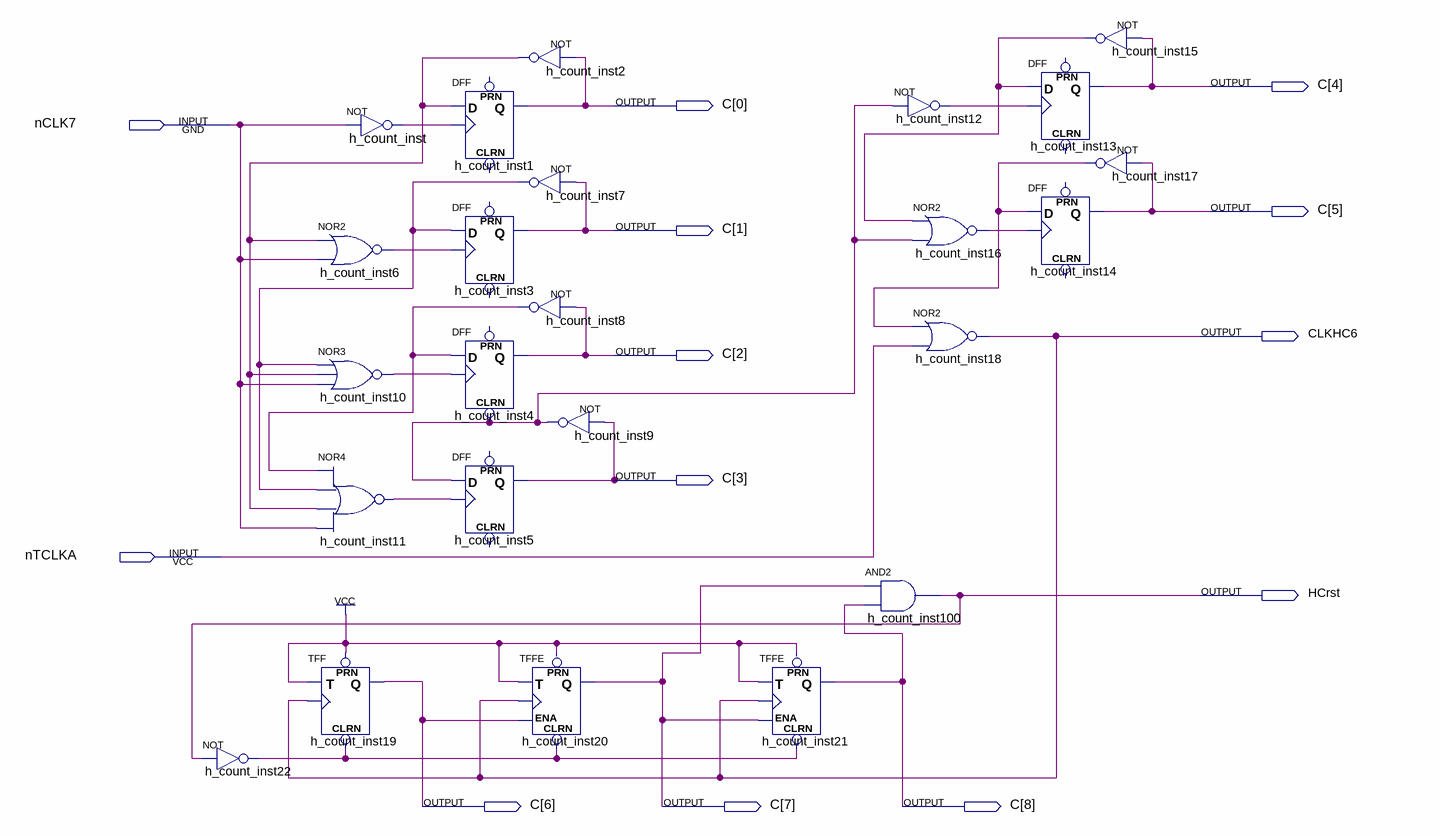
[diagram p0: schematic sheet]
// Quartus schematic ula_h_counter.bdf as structural Verilog: 24 symbols, 13 pins
module ula_h_counter (
  input  nCLK7,
  input  nTCLKA,
  output [8:0] C,
  output CLKHC6,
  output HCrst
);

  wire h_count_inst2_out, h_count_inst6_out, h_count_inst7_out, h_count_inst8_out, h_count_inst9_out,
       h_count_inst10_out, h_count_inst11_out, h_count_inst12_out, h_count_inst15_out, h_count_inst16_out,
       h_count_inst17_out, h_count_inst22_out, h_count_inst_out;

  not h_count_inst22 (h_count_inst22_out, HCrst);
  not h_count_inst (h_count_inst_out, nCLK7);
  nor h_count_inst6 (h_count_inst6_out, h_count_inst2_out, nCLK7);
  nor h_count_inst10 (h_count_inst10_out, h_count_inst7_out, h_count_inst2_out, nCLK7);
  nor h_count_inst11 (h_count_inst11_out, h_count_inst8_out, h_count_inst7_out, h_count_inst2_out, nCLK7);
  TFF h_count_inst19 (.PRN(1'b1), .CLRN(h_count_inst22_out), .T(1'b1), .CLK(CLKHC6), .Q(C[6]));
  DFF h_count_inst1 (.CLK(h_count_inst_out), .D(h_count_inst2_out), .Q(C[0]));  // open: CLRN, PRN
  DFF h_count_inst3 (.CLK(h_count_inst6_out), .D(h_count_inst7_out), .Q(C[1]));  // open: CLRN, PRN
  DFF h_count_inst4 (.CLRN(h_count_inst9_out), .CLK(h_count_inst10_out), .D(h_count_inst8_out), .Q(C[2]));  // open: PRN
  DFF h_count_inst5 (.CLK(h_count_inst11_out), .D(h_count_inst9_out), .Q(C[3]));  // open: CLRN, PRN
  not h_count_inst2 (h_count_inst2_out, C[0]);
  not h_count_inst7 (h_count_inst7_out, C[1]);
  not h_count_inst8 (h_count_inst8_out, C[2]);
  not h_count_inst9 (h_count_inst9_out, C[3]);
  TFFE h_count_inst20 (.CLRN(h_count_inst22_out), .T(1'b1), .CLK(CLKHC6), .ENA(C[6]), .PRN(1'b1), .Q(C[7]));
  TFFE h_count_inst21 (.CLRN(h_count_inst22_out), .T(1'b1), .CLK(CLKHC6), .ENA(C[7]), .PRN(1'b1), .Q(C[8]));
  and h_count_inst100 (HCrst, C[7], C[8]);
  not h_count_inst12 (h_count_inst12_out, h_count_inst9_out);
  nor h_count_inst16 (h_count_inst16_out, h_count_inst15_out, h_count_inst9_out);
  nor h_count_inst18 (CLKHC6, h_count_inst17_out, nTCLKA);
  DFF h_count_inst13 (.CLK(h_count_inst12_out), .D(h_count_inst15_out), .Q(C[4]));  // open: CLRN, PRN
  DFF h_count_inst14 (.CLK(h_count_inst16_out), .D(h_count_inst17_out), .Q(C[5]));  // open: CLRN, PRN
  not h_count_inst15 (h_count_inst15_out, C[4]);
  not h_count_inst17 (h_count_inst17_out, C[5]);
endmodule
